# EAGLE schematic programmer (EAGLE 9.6.2)
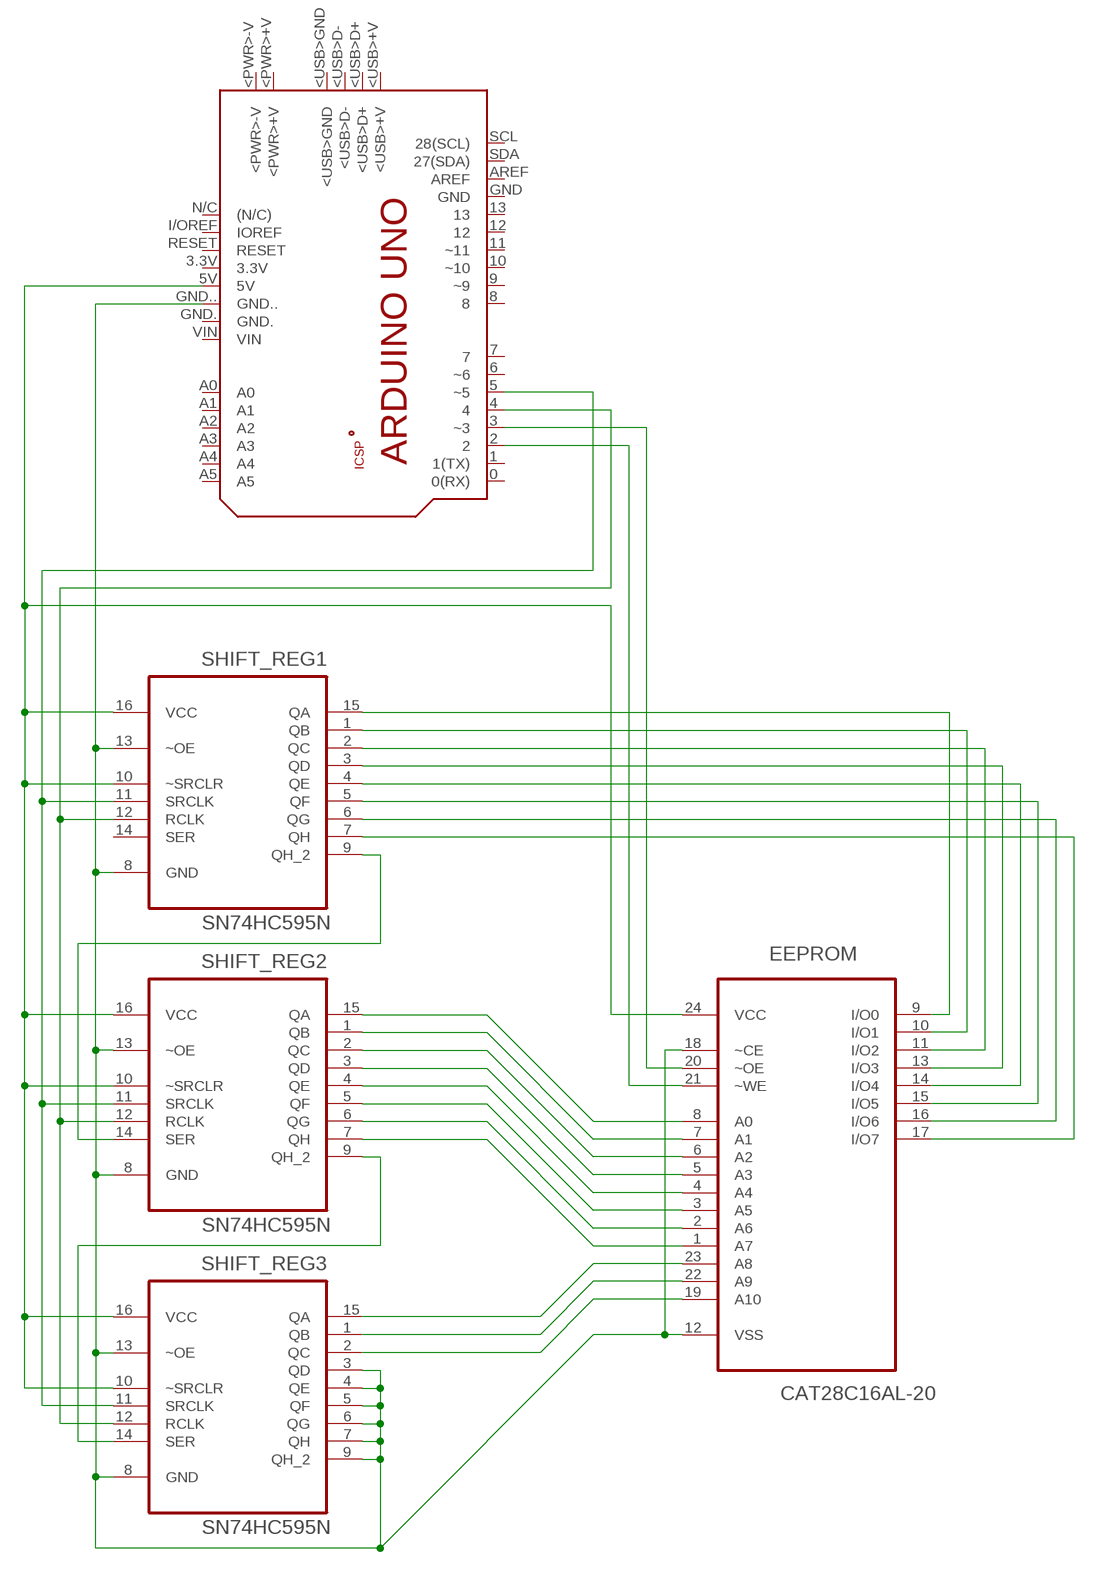
[diagram p0: schematic, sheet 1]

## Parts
EEPROM  CAT28C16AL-20  [DIP254P1524X635-24]
MCU  ARDUINO_UNO  [ARDUINO_UNO]
SHIFT_REG1  SN74HC595N  [DIP254P762X508-16]
SHIFT_REG2  SN74HC595N  [DIP254P762X508-16]
SHIFT_REG3  SN74HC595N  [DIP254P762X508-16]

## Nets
N$1: EEPROM.24(VCC) MCU.5V SHIFT_REG1.10(~SRCLR) SHIFT_REG1.16(VCC) SHIFT_REG2.10(~SRCLR) SHIFT_REG2.16(VCC) SHIFT_REG3.10(~SRCLR) SHIFT_REG3.16(VCC)
N$2: SHIFT_REG2.9(QH_2) SHIFT_REG3.14(SER)
N$3: MCU.4 SHIFT_REG1.12(RCLK) SHIFT_REG2.12(RCLK) SHIFT_REG3.12(RCLK)
N$4: MCU.5(~5) SHIFT_REG1.11(SRCLK) SHIFT_REG2.11(SRCLK) SHIFT_REG3.11(SRCLK)
N$5: EEPROM.9(I/O0) SHIFT_REG1.15(QA)
N$6: SHIFT_REG1.9(QH_2) SHIFT_REG2.14(SER)
N$7: EEPROM.10(I/O1) SHIFT_REG1.1(QB)
N$8: EEPROM.12(VSS) EEPROM.18(~CE) MCU.GND.. SHIFT_REG1.8(GND) SHIFT_REG1.13(~OE) SHIFT_REG2.8(GND) SHIFT_REG2.13(~OE) SHIFT_REG3.3(QD) SHIFT_REG3.4(QE) SHIFT_REG3.5(QF) SHIFT_REG3.6(QG) SHIFT_REG3.7(QH) SHIFT_REG3.8(GND) SHIFT_REG3.9(QH_2) SHIFT_REG3.13(~OE)
N$9: EEPROM.11(I/O2) SHIFT_REG1.2(QC)
N$10: EEPROM.13(I/O3) SHIFT_REG1.3(QD)
N$11: EEPROM.14(I/O4) SHIFT_REG1.4(QE)
N$12: EEPROM.15(I/O5) SHIFT_REG1.5(QF)
N$13: EEPROM.16(I/O6) SHIFT_REG1.6(QG)
N$14: EEPROM.17(I/O7) SHIFT_REG1.7(QH)
N$16: EEPROM.20(~OE) MCU.3(~3)
N$17: EEPROM.21(~WE) MCU.2
N$18: EEPROM.7(A1) SHIFT_REG2.1(QB)
N$19: EEPROM.8(A0) SHIFT_REG2.15(QA)
N$20: EEPROM.6(A2) SHIFT_REG2.2(QC)
N$21: EEPROM.5(A3) SHIFT_REG2.3(QD)
N$22: EEPROM.4(A4) SHIFT_REG2.4(QE)
N$23: EEPROM.3(A5) SHIFT_REG2.5(QF)
N$24: EEPROM.2(A6) SHIFT_REG2.6(QG)
N$25: EEPROM.1(A7) SHIFT_REG2.7(QH)
N$32: EEPROM.23(A8) SHIFT_REG3.15(QA)
N$33: EEPROM.22(A9) SHIFT_REG3.1(QB)
N$34: EEPROM.19(A10) SHIFT_REG3.2(QC)
Unconnected: MCU.0(0(RX)) MCU.1(1(TX)) MCU.3.3V MCU.6(~6) MCU.7 MCU.8 MCU.9(~9) MCU.10(~10) MCU.11(~11) MCU.12 MCU.13 MCU.+5V MCU.<PWR>+V MCU.<PWR>-V MCU.<USB>+V MCU.<USB>D+ MCU.<USB>D- MCU.<USB>GND MCU.A0 MCU.A1 MCU.A2 MCU.A3 MCU.A4 MCU.A5 MCU.AREF MCU.GND MCU.GND. MCU.GND_ MCU.I/OREF(IOREF) MCU.MISO MCU.MOSI MCU.N/C((N/C)) MCU.RESET MCU.RESET. MCU.SCK MCU.SCL(28(SCL)) MCU.SDA(27(SDA)) MCU.VIN SHIFT_REG1.14(SER)

## Library data of the parts
EEPROM = Catalyst_Semiconductor_By_element14_Batch_1:CAT28C16AL-20: 16 kb CMOS Parallel EEPROM; MPN: CAT28C16AL-20; OC_FARNELL: 1718291; OC_NEWARK: 06R0646; PACKAGE: PDIP-24; SUPPLIER: CATALYST SEMICONDUCTOR
MCU = E14_Arduino_revC:ARDUINO_UNO: Device for representing an Arduino Uno board with a footprint in an EAGLE design. Created by Dave Young for Element14. More EAGLE documentation at: http://www.element14.com/community/community/knode/cadsoft_eagle
SHIFT_REG1-SHIFT_REG3 = Texas Instruments_By_element14_Batch_1:SN74HC595N: 8-BIT SHIFT REGISTERS WITH 3-STATE OUTPUT REGISTERS; MPN: SN74HC595N; OC_FARNELL: 9591664; OC_NEWARK: 60K6845; PACKAGE: PDIP-16; SUPPLIER: Texas Instruments